# EasyEDA Pro project ProProject_Stc32f_Car副本_2024-06-03.epro, schematic schematic1
Create Date: 2024-04-18; Page Name: P1; Project Name: Stc32f_Car; Schematic Name: Schematic1; Update Date: 2024-04-30; Company: 嘉立创EDA; Page Size: A4; Version: V1.0
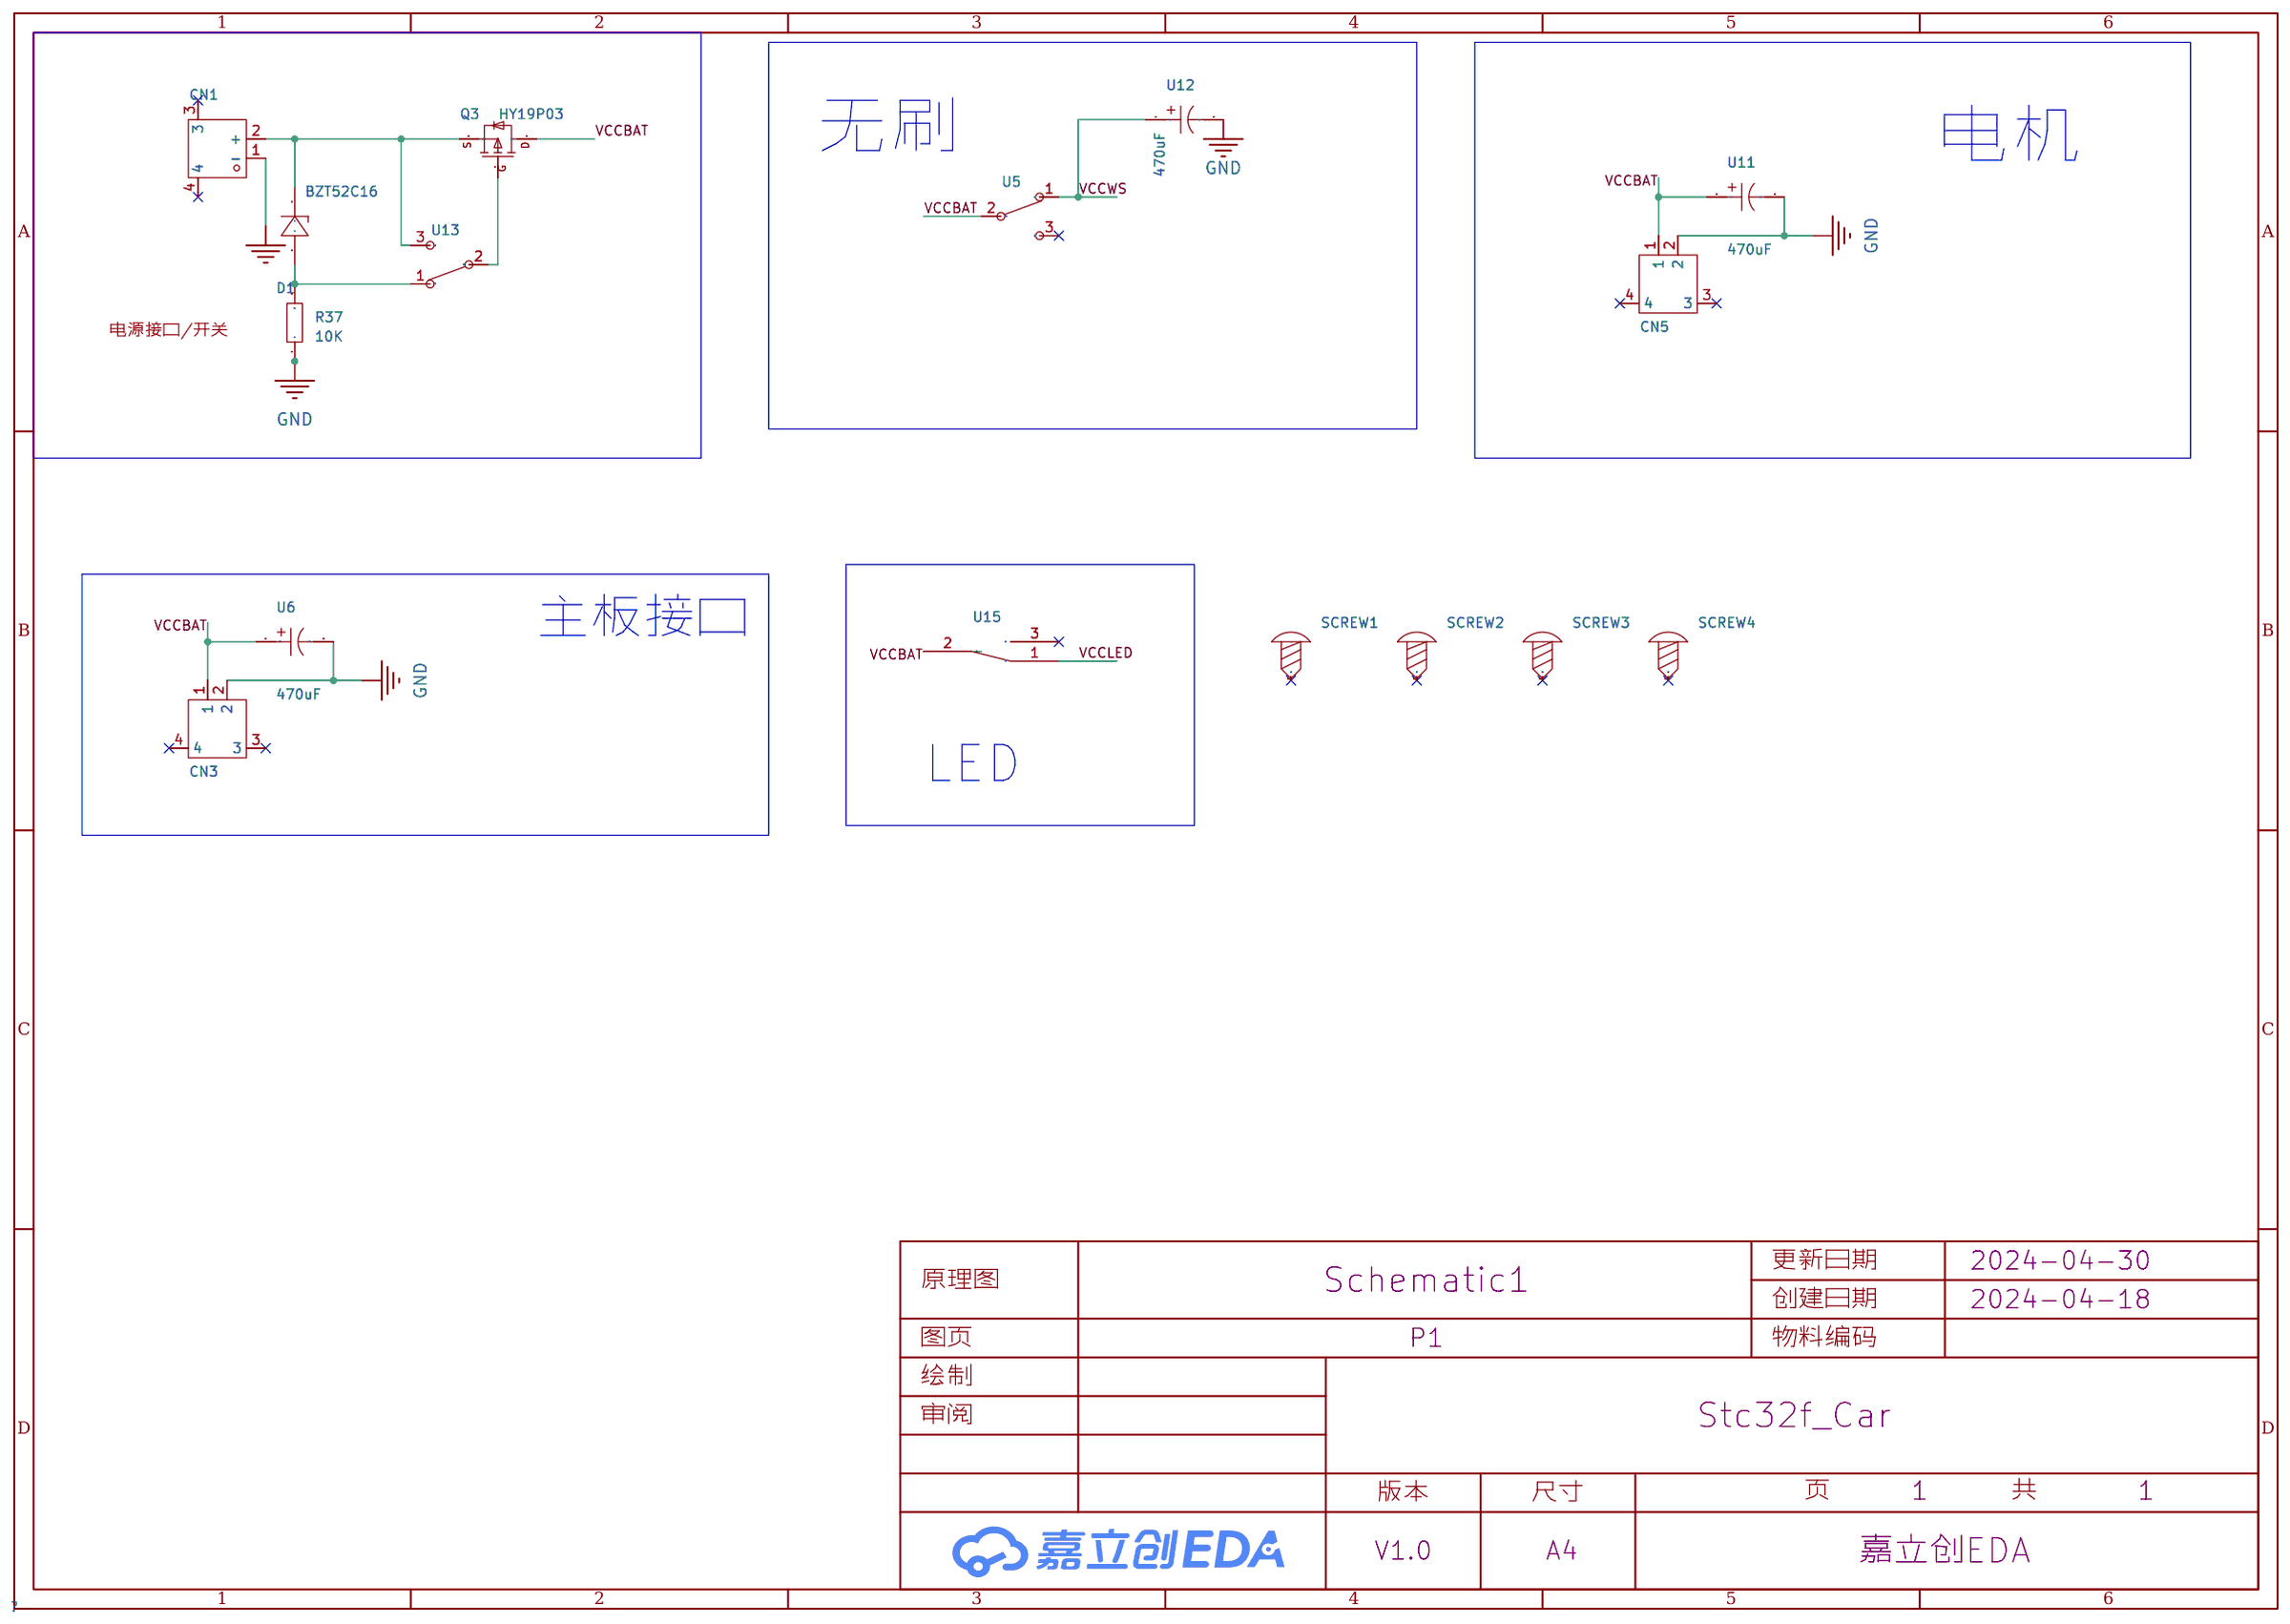
[diagram p0: schematic sheet]

## Parts
CN1  XT60PW-M  [CONN-TH_XT60PW-M]
CN3  XT30PW-M  [CONN-TH_XT30PW-M]
CN5  XT30PW-M  [CONN-TH_XT30PW-M]
D1  BZT52C16  [SOD-123-L]
Q3  HY19P03  [TO-252AA]
R37  10K  [R0603]
SCREW1  -  [M3螺丝]
SCREW2  -  [M3螺丝]
SCREW3  -  [M3螺丝]
SCREW4  -  [M3螺丝]
U5  7107SYZ3QE  [SW-TH_3P-L12.7-W6.8-P4.70]
U6  470uF  [CAP-TH_BD10.0-P5.00-D0.6-FD]
U11  470uF  [CAP-TH_BD10.0-P5.00-D0.6-FD]
U12  470uF  [CAP-TH_BD10.0-P5.00-D0.6-FD]
U13  7107SYZ3QE  [SW-TH_3P-L12.7-W6.8-P4.70]
U15  ST-0-102-A01-T000-LF  [SW-TH_3P-L8.3-W5.2-P2.54_ST-0-102-A01-T000]

## Library data of the parts
CN1 = XT60PW-M: 类别:-;类型1:-;; LCSC Part Name: AMASS(艾迈斯)航模插头xt60连接器150公母对接pw锂电池公头 板插卧式XT60PW-M; Supplier Part: C98732; Manufacturer: AMASS(艾迈斯); JLCPCB Part Class: 扩展库; Datasheet: https://atta.szlcsc.com/upload/public/pdf/source/20240118/44A3DCFF53BE25DC65378AFFB21277A4.pdf; Supplier: LCSC; Brand: 艾迈斯; Type: 卧式插头; Colour: 黄色; InterfaceType: 公头
CN3 CN5 = XT30PW-M: 类别:-;类型1:-;; LCSC Part Name: AMASS(艾迈斯)航模插头 卧式弯脚 XT30PW-M公头; Supplier Part: C431092; Manufacturer: AMASS(艾迈斯); JLCPCB Part Class: 扩展库; Datasheet: https://atta.szlcsc.com/upload/public/pdf/source/20220222/6A9F22F7850E25B33E1BE430ADF8560B.pdf; Supplier: LCSC; Brand: 艾迈斯; Type: 航模插头; RatedVoltage: DC 500V; InterfaceType: 公头; RatedCurrent: 15A; RecommendedWireGauge: 16/18/20AWG; contact resistance: 1.2mΩ; specifications: 2pin
D1 = Diode Zen: Published: 8-Jun-2000; Revision: July-2002: Re-released for DXP Platform.; Publisher: Altium Limited; Price(RMB): 0.000; Origin Footprint 2: DIODE-0.7; Origin Footprint 3: DIODE-0.4; Origin Footprint 4: SOD-87[LL-41]; Origin Footprint 5: CD4521-1808; Origin Footprint 6: SOD-80[LL-34]; Origin Footprint 7: SOD-123-FL; Origin Footprint 8: SOD-123-M; Origin Footprint 9: SOD-323; Origin Footprint 10: SOD-523-L; Origin Footprint 11: SOD-523-M
Q3 = HY19P03
R37 = Res_0603: Supplier Footprint: 0603
SCREW1-SCREW4 = M3螺丝: Supplier Footprint: 插件
U5 U13 = 7107SYZ3QE: 电路结构:单刀双掷;额定电压(AC):120V;额定电压(DC):28V;安装方式:直插;; LCSC Part Name: 7107SYZ3QE 五件套; Supplier Part: C2807218; Manufacturer: C&K; Supplier Footprint: 插件; JLCPCB Part Class: 扩展库; Datasheet: https://atta.szlcsc.com/upload/public/pdf/source/20211115/F8CC6A82C29CD42100901D8BBE4E1986.pdf; Supplier: LCSC; Circuit: 单刀双掷; Voltage Rating (AC): 120V; Voltage Rating (DC): 28V; Actuator Type: 圆柱钮柄; Mounting Style: 直插; Operating Temperature: -30℃~+85℃
U6 U11 U12 = 03EC0563: 容值:470uF;精度:±20%;额定电压:35V;纹波电流:480mA@120kHz;等效串联电阻:-;; LCSC Part Name: 470uF ±20% 35V; Supplier Part: C2687410; Manufacturer: KNSCHA(科尼盛); Supplier Footprint: 插件,D10xL16mm; JLCPCB Part Class: 扩展库; Datasheet: https://atta.szlcsc.com/upload/public/pdf/source/20210128/C2687410_09D5236BC46E67836277EE63A33C2923.pdf; Supplier: LCSC; Tolerance: ±20%; Rated Voltage: 35V; Ripple Current: 480mA@120kHz; Lead Spacing: 5mm; φD: 10mm; L: 16mm; Lifetime @ Temp: 2000hrs@105℃; Operating Temperature: -40℃~+105℃
U15 = ST-0-102-A01-T000-LF: 电路结构:单刀双掷;机械寿命:-;额定电流:3A;额定电压(AC):125V;安装方式:直插;; LCSC Part Name: 超小型钮子三脚二档 五件套 含配件; Supplier Part: C1788487; Manufacturer: YUEN FUNG(源丰); Supplier Footprint: 插件; JLCPCB Part Class: 扩展库; Datasheet: https://atta.szlcsc.com/upload/public/pdf/source/20230720/31DDFEC61AC21D005BE18E754C3E93F0.pdf; Supplier: LCSC; Circuit: 单刀双掷; Switch Length: 8.3mm; Switch Width: 5.2mm; Switch Height: 23.6mm; Contact Current: 3A; Voltage Rating (AC): 125V; Actuator Type: 圆柱钮柄; Pin Style: 焊片; Mounting Style: 直插; Operating Temperature: -25℃~+85℃

## Nets
GND: CN1.1(-) CN3.2 CN5.2 R37.1 U6.2 U11.2 U12.2
VCCBAT: CN3.1 CN5.1 Q3.1(D) U5.2(COMM) U6.1 U11.1 U15.2
VCCLED: U15.1
VCCWS: U5.1(ON) U12.1
$1N4623: Q3.2(G) U13.2(COMM)
$1N4630: D1.A R37.2 U13.1(ON)
$1N4637: CN1.2(+) D1.K Q3.3(S) U13.3(NC)

Not connected (* = marked no-connect by the designer): CN1 3* 4*; CN3 3* 4*; CN5 3* 4*; SCREW1 1*; SCREW2 1*; SCREW3 1*; SCREW4 1*; U5 3(NC)*; U15 3*

## Notes on the sheet
- 无刷
- 电机
- 电源接口/开关
- 主板接口
- LED
